# Altium schematic sheet POWER_IN.SchDoc
size A4; SheetNumber: 2; SheetTotal: 7
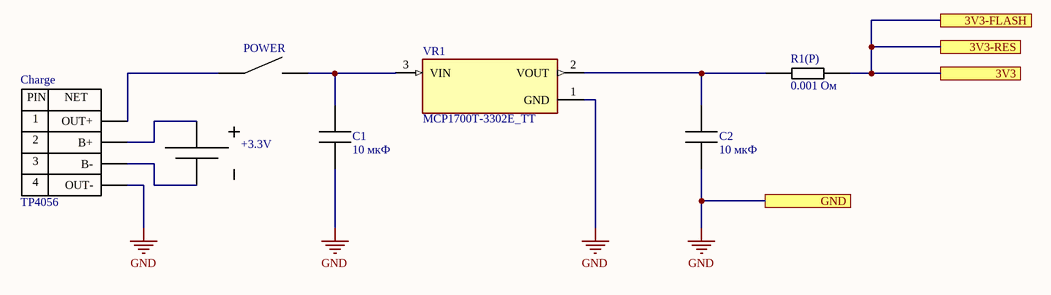
[diagram p0: POWER_IN.SchDoc]

## Parts
+3.3V  Battery  [Battery connect]  (value not drawn)
C1  10 мкФ  [Murata GRM21BR60J106K]
C2  10 мкФ  [Murata GRM21BR60J106K]
Charge  TP4056  [TP4056]
POWER  SMRS-101-1C2  [Button]  (value not drawn)
R1(P)  0.001 Ом  [Resistor 0.001]
VR1  MCP1700T-3302E_TT  [SOT95P237X112-3N]

## Ports
3V3 (see TOP_LEVEL[1A], MODULES[1C]), 3V3-FLASH (see TOP_LEVEL[1A], FLASH[3B]), 3V3-RES (see TOP_LEVEL[1A], MODULES[4A]), GND (see TOP_LEVEL[1A], FLASH[3C], MODULES[2D], NFC[2C], SWD[2B], USB[2C])

## Nets
GND: C1.1 C2.1 Charge.4(OUT-) VR1.1(GND) ; port GND
3V3: R1(P).2 ; port 3V3, port 3V3-RES, port 3V3-FLASH
Net+3.3V_1: +3.3V.1 Charge.3(B-)
Net+3.3V_2: +3.3V.2 Charge.2(B+)
NetC1_2: C1.2 POWER.2 VR1.3(VIN)
NetC2_2: C2.2 R1(P).1 VR1.2(VOUT)
NetCharge_1: Charge.1(OUT+) POWER.1

## Notes on the sheet
- (in symbol TP4056) PIN; NET

## Library data of the parts
C1 C2 = Murata GRM21BR60J106K
POWER = Button
R1(P) = YAGEO PA2512FKF7W0R001E
VR1 = MCP1700T-3302E_TT: Pwr Sply Func,Voltage Regulator,LDO,SOT-23,PD 369.6mW,VO 3.3V,Regline +/-0.75%/V | Microchip Technology Inc. MCP1700T-3302E/TT; SnapEDA_Link: https://www.snapeda.com/parts/MCP1700T-3302E/TT/Microchip/view-part/?ref=snap; Package: SOT-23 Microchip; Value: *; MF: Microchip; MP: MCP1700T-3302E/TT; Check_prices: https://www.snapeda.com/parts/MCP1700T-3302E/TT/Microchip/view-part/?ref=eda